# EAGLE schematic para (EAGLE 6.5.0)
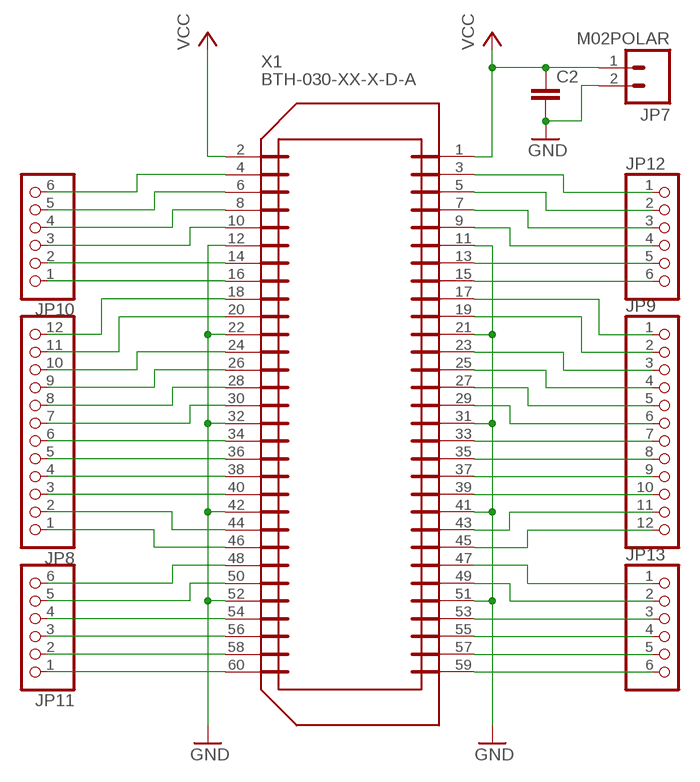
[diagram p0: schematic, sheet 1]

## Parts
C2  CAP0805  [0805]
JP7  M02POLAR  [MOLEX-1X2]
JP8  PINHD-1X12-CB  [1X12-CB]
JP9  PINHD-1X12-CB  [1X12-CB]
JP10  PINHD-1X6CB  [1X06-CLEANBIG]
JP11  PINHD-1X6CB  [1X06-CLEANBIG]
JP12  PINHD-1X6CB  [1X06-CLEANBIG]
JP13  PINHD-1X6CB  [1X06-CLEANBIG]
X1  BTH-030-XX-X-D-A  [BTH-030-XX-X-D-A]

## Nets
GND [gnd]: C2.2 JP7.2 X1.11 X1.12 X1.21 X1.22 X1.31 X1.32 X1.41 X1.42 X1.51 X1.52
GPIO0_N [sig]: JP12.1 X1.3
GPIO0_P [sig]: JP12.2 X1.5
GPIO1_N [sig]: JP10.6 X1.4
GPIO1_P [sig]: JP10.5 X1.6
GPIO2_N [sig]: JP12.3 X1.7
GPIO2_P [sig]: JP12.4 X1.9
GPIO3_N [sig]: JP10.4 X1.8
GPIO3_P [sig]: JP10.3 X1.10
GPIO4_N [sig]: JP12.5 X1.13
GPIO4_P [sig]: JP12.6 X1.15
GPIO5_N [sig]: JP10.2 X1.14
GPIO5_P [sig]: JP10.1 X1.16
GPIO6_N [sig]: JP9.1 X1.17
GPIO6_P [sig]: JP9.2 X1.19
GPIO7_N [sig]: JP8.12 X1.18
GPIO7_P [sig]: JP8.11 X1.20
GPIO8_N [sig]: JP9.3 X1.23
GPIO8_P [sig]: JP9.4 X1.25
GPIO9_N [sig]: JP8.10 X1.24
GPIO9_P [sig]: JP8.9 X1.26
GPIO10_N [sig]: JP9.5 X1.27
GPIO10_P [sig]: JP9.6 X1.29
GPIO11_N [sig]: JP8.8 X1.28
GPIO11_P [sig]: JP8.7 X1.30
GPIO12_N [sig]: JP9.7 X1.33
GPIO12_P [sig]: JP9.8 X1.35
GPIO13_N [sig]: JP8.6 X1.34
GPIO13_P [sig]: JP8.5 X1.36
GPIO14_N [sig]: JP9.9 X1.37
GPIO14_P [sig]: JP9.10 X1.39
GPIO15_N [sig]: JP8.4 X1.38
GPIO15_P [sig]: JP8.3 X1.40
GPIO16_N [sig]: JP9.11 X1.43
GPIO16_P [sig]: JP9.12 X1.45
GPIO17_N [sig]: JP8.2 X1.44
GPIO17_P [sig]: JP8.1 X1.46
GPIO18_N [sig]: JP13.1 X1.47
GPIO18_P [sig]: JP13.2 X1.49
GPIO19_N [sig]: JP11.6 X1.48
GPIO19_P [sig]: JP11.5 X1.50
GPIO20_N [sig]: JP13.3 X1.53
GPIO20_P [sig]: JP13.4 X1.55
GPIO21_N [sig]: JP11.4 X1.54
GPIO21_P [sig]: JP11.3 X1.56
GPIO22_N [sig]: JP13.5 X1.57
GPIO22_P [sig]: JP13.6 X1.59
GPIO23_N [sig]: JP11.2 X1.58
GPIO23_P [sig]: JP11.1 X1.60
VCC [gnd]: C2.1 JP7.1 X1.1 X1.2

## Library data of the parts
C2 = SparkFun-Capacitors:CAP: Capacitor Standard 0603 ceramic capacitor, and 0.1" leaded capacitor.
JP7 = SparkFun-Connectors:M02: Standard 2-pin 0.1" header. Use with - straight break away headers ( PRT-00116) - right angle break away headers (PRT-00553) - swiss pins (PRT-00743) - machine pins (PRT-00117) - female headers (PRT-00115) Molex polarized connector foot print use with: PRT-08233 with associated crimp pins and housings. 2.54_SCREWTERM for use with PRT-10571. 3.5mm Screw Terminal footprints for PRT-08084 5mm Screw Terminal footprints for use with PRT-08433
JP8 JP9 = adafruit:PINHD-1X12: PIN HEADER
JP10-JP13 = adafruit:PINHD-1X6: PIN HEADER
X1 = parallella:BTH-030-XX-X-D-A: SAMTEC BTH-030-XX-X-D-A connectors 0,50 mm Basic Blade & Beam Terminal Strip

## Net classes
0 default: width 0.254 mm, drill 0.305 mm, clearance 0.254 mm
1 gnd: width 0.254 mm, drill 0.305 mm, clearance 0.914 mm
2 sig: width 0.152 mm, drill 0.305 mm, clearance 0.152 mm